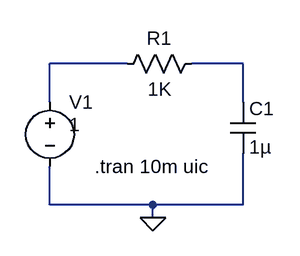
[diagram p0: schematic 01.asc]
01.asc, the LTspice schematic file:
Version 4
SHEET 1 880 680
WIRE 128 96 32 96
WIRE 272 96 208 96
WIRE 32 144 32 96
WIRE 272 144 272 96
WIRE 32 272 32 224
WIRE 160 272 32 272
WIRE 272 272 272 208
WIRE 272 272 160 272
WIRE 160 288 160 272
FLAG 160 288 0
SYMBOL voltage 32 128 R0
WINDOW 3 24 44 Left 2
WINDOW 123 0 0 Left 0
WINDOW 39 0 0 Left 0
SYMATTR InstName V1
SYMATTR Value 1
SYMBOL res 112 112 R270
WINDOW 0 32 56 VTop 2
WINDOW 3 0 56 VBottom 2
SYMATTR InstName R1
SYMATTR Value 1K
SYMBOL cap 256 144 R0
SYMATTR InstName C1
SYMATTR Value 1µ
TEXT 88 224 Left 2 !.tran 10m uic

The netlist it stands for:
* 01.asc
V1 N001 0 1
R1 N001 N002 1K
C1 N002 0 1µ
.tran 10m uic
.backanno
.end